# Altium schematic sheet 1_Board.schdoc.schdoc
size 309 x 223 mm; Symbol: Sheet-Symbol_A4; Device: Sheet-Symbol_A4; @Page Name: Board; @Create Date: 2023-10-25; @Page Count: 4; @Page No: 1; @Project Name: New Project_2023-10-25_23-03-02; @Schematic Name: Schematic1; @Update Date: 2023-11-27; Company: 嘉立创EDA; Page Size: A4; Version: V1.0; SheetNumber: 3; SheetTotal: 4
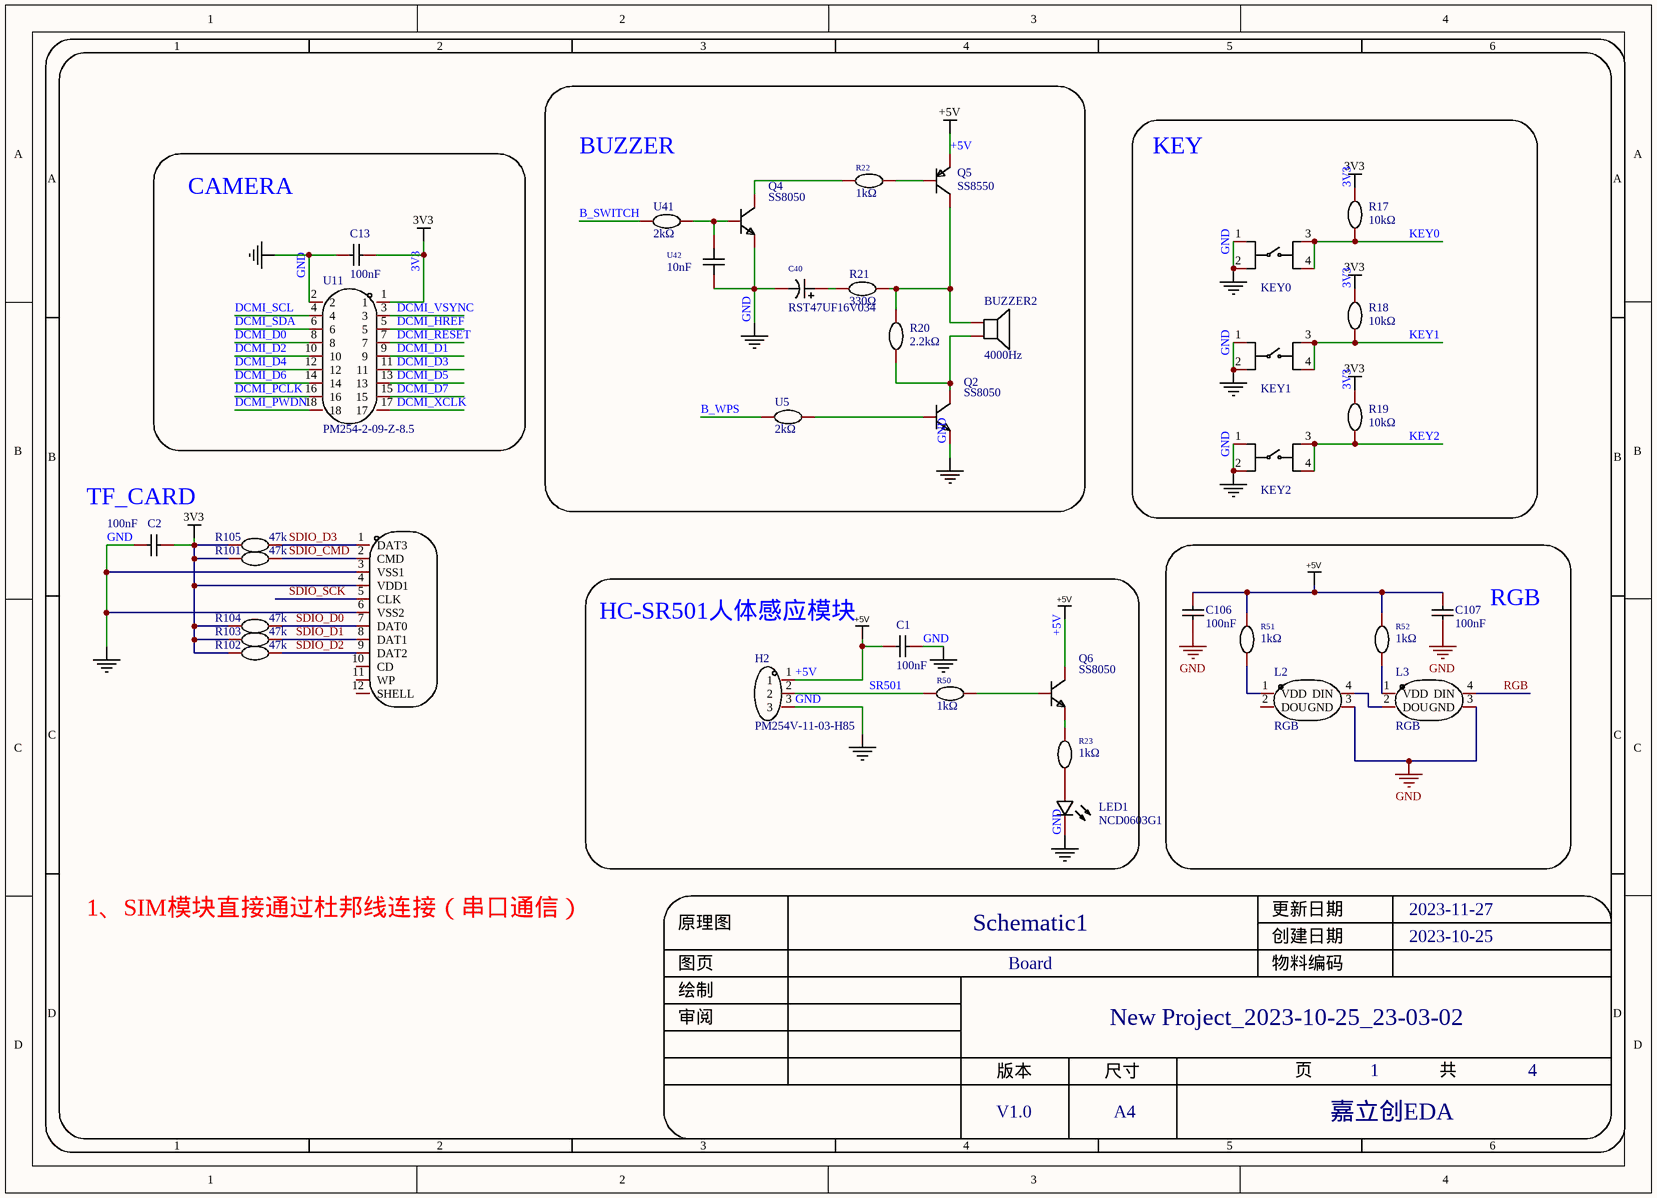
[diagram p0: 1_Board.schdoc.schdoc]

## Parts
BUZZER2  4000Hz  [BUZ-TH_BD14.0-P7.60-D0.7-FD]
C1  100nF  [C0603]
C2  100nF  [C0603]
C13  100nF  [C0603]
C40  RST47UF16V034  [CAP-SMD_BD5.0-L5.3-W5.3-LS6.0-FD]
C106  100nF  [C0603]
C107  100nF  [C0603]
H2  PM254V-11-03-H85  [HDR-TH_3P-P2.54-V-F]
KEY0  K2-6639SP-C4SC-04  [KEY-SMD_4P-L6.0-W6.0-P3.90-LS10.0]  (value not drawn)
KEY1  K2-6639SP-C4SC-04  [KEY-SMD_4P-L6.0-W6.0-P3.90-LS10.0]  (value not drawn)
KEY2  K2-6639SP-C4SC-04  [KEY-SMD_4P-L6.0-W6.0-P3.90-LS10.0]  (value not drawn)
L2  RGB  [RGB]
L3  RGB  [RGB]
LED1  NCD0603G1  [LED0603-RD]
Q2  SS8050  [SOT-23-3_L2.9-W1.3-P1.90-LS2.4-BR]
Q4  SS8050  [SOT-23-3_L2.9-W1.3-P1.90-LS2.4-BR]
Q5  SS8550  [SOT-23-3_L2.9-W1.3-P1.90-LS2.4-BR]
Q6  SS8050  [SOT-23-3_L2.9-W1.3-P1.90-LS2.4-BR]
R17  10kΩ  [R0603]
R18  10kΩ  [R0603]
R19  10kΩ  [R0603]
R20  2.2kΩ  [R0603]
R21  330Ω  [R0603]
R22  1kΩ  [R0603]
R23  1kΩ  [R0603]
R50  1kΩ  [R0603]
R51  1kΩ  [R0603]
R52  1kΩ  [R0603]
R101  47k  [R0603]
R102  47k  [R0603]
R103  47k  [R0603]
R104  47k  [R0603]
R105  47k  [R0603]
SD??  SD-112  [PCBComponent_1]  (value not drawn)
U5  2kΩ  [R0603]
U11  PM254-2-09-Z-8.5  [HDR-TH_18P-P2.54-V-F-R2-C9-S2.54]
U41  2kΩ  [R0603]
U42  10nF  [C0603]

## Blocks framed on the sheet
BUZZER: BUZZER2 C40 Q2 Q4 Q5 R20-R22 U5 U41 U42
KEY: KEY0-KEY2 R17-R19
CAMERA: C13 U11
RGB: C106 C107 L2 L3 R51 R52
HC-SR501人体感应模块: C1 H2 LED1 Q6 R23 R50

## Nets
3V3: C2.2 C13.2 R17.2 R18.2 R19.2 R101.2 R102.2 R103.2 R104.2 R105.2 SD??.4(VDD1) U11.1
+5V: C1.2 C106.1 C107.1 H2.1 Q5.2(E) Q6.3(C) R51.2 R52.2
GND: C1.1 C2.1 C13.1 C40.2 C106.2 C107.2 H2.3 KEY0.1 KEY0.2 KEY1.1 KEY1.2 KEY2.1 KEY2.2 L2.3(GND) L3.3(GND) LED1.1(K) Q2.2(E) Q4.2(E) SD??.3(VSS1) SD??.6(VSS2) U11.2 U42.1
B_SWITCH: U41.2
B_WPS: U5.2
DCMI_D0: U11.8
DCMI_D1: U11.9
DCMI_D2: U11.10
DCMI_D3: U11.11
DCMI_D4: U11.12
DCMI_D5: U11.13
DCMI_D6: U11.14
DCMI_D7: U11.15
DCMI_HREF: U11.5
DCMI_PCLK: U11.16
DCMI_PWDN: U11.18
DCMI_RESET: U11.7
DCMI_SCL: U11.4
DCMI_SDA: U11.6
DCMI_VSYNC: U11.3
DCMI_XCLK: U11.17
KEY0: KEY0.3 KEY0.4 R17.1
KEY1: KEY1.3 KEY1.4 R18.1
KEY2: KEY2.3 KEY2.4 R19.1
RGB: L3.4(DIN)
SDIO_CMD: R101.1 SD??.2(CMD)
SDIO_D0: R104.1 SD??.7(DAT0)
SDIO_D1: R103.1 SD??.8(DAT1)
SDIO_D2: R102.1 SD??.9(DAT2)
SDIO_D3: R105.1 SD??.1(DAT3)
SDIO_SCK: SD??.5(CLK)
SR501: H2.2 R50.2
NetBUZZER2_1: BUZZER2.1 Q5.3(C) R20.2 R21.2
NetBUZZER2_2: BUZZER2.2 Q2.3(C) R20.1
NetC40_1: C40.1 R21.1
NetL2_1: L2.1(VDD) R51.1
NetL2_4: L2.4(DIN) L3.2(DOU)
NetL3_1: L3.1(VDD) R52.1
NetLED1_2: LED1.2(A) R23.1
NetQ2_1: Q2.1(B) U5.1
NetQ4_1: Q4.1(B) U41.1 U42.2
NetQ4_3: Q4.3(C) R22.1
NetQ5_1: Q5.1(B) R22.2
NetQ6_1: Q6.1(B) R50.1
NetQ6_2: Q6.2(E) R23.2

Not connected (* = marked no-connect by the designer): L2 2(DOU); SD?? 10(CD) 11(WP) 12(SHELL)

## Notes on the sheet
- (near C2) TF_CARD
- 1、SIM模块直接通过杜邦线连接（串口通信）
- 1
- 2
- 3
- 4
- 5
- 6
- A
- B
- C
- 原理图
- Schematic1
- 创建日期
- 更新日期
- 2023-10-25
- 2023-11-27
- D
- 审阅
- 绘制
- 图页
- Board
- 物料编码
- New Project_2023-10-25_23-03-02
- 版本
- 尺寸
- 页
- 共
- V1.0
- A4
- 嘉立创EDA

## Library data of the parts
BUZZER2 = SFN-1407PA7.6: 驱动方式:无源(外部驱动);构造类型:压电式;额定电压:-;工作电压:-;消耗电流:-;频率:4000Hz;声压(SPL):85dB@5V,10cm;直径(φD):14mm;长度:-;宽度:-;高度:7.5mm;工作温度:-;; Manufacturer: S&amp;S(海旭); Add into BOM: yes; Technology Type: 压电式; Name: 4000Hz; Symbol: SFN-1407PA7.6; Device: SFN-1407PA7.6; LCSC Part Name: 压电无源蜂鸣器; Supplier Part: C360603; Manufacturer Part: SFN-1407PA7.6; Supplier Footprint: 插件,P=7.6mm; JLCPCB Part Class: 扩展库; Datasheet: https://atta.szlcsc.com/upload/public/pdf/source/20190422/C360603_0050A9658ADA60D80C9948846F925782.pdf; Supplier: LCSC; Convert to PCB: yes; Oscillator Circuit: 无源(外部驱动); Rated Voltage: -; Operating Voltage: -; Current Consumption: -; Value: 4000Hz; Sound Pressure Level (SPL): 85dB@5V,10cm; Diameter (φD): 14mm; Length: -; Width: -; Height: 7.5mm; Operating Temperature: -
C1 C2 C13 C106 C107 = 0603B104K500NT: 容值:100nF;精度:±10%;额定电压:50V;材质(温度系数):X7R;; Manufacturer: FH(风华); Add into BOM: yes; Tolerance: ±10%; Voltage Rated: 50V; Temperature Coefficient: X7R; Name: 100nF; Symbol: 0603B104K500NT; Device: 0603B104K500NT; LCSC Part Name: 100nF ±10% 50V; Supplier Part: C30926; Manufacturer Part: 0603B104K500NT; Supplier Footprint: 0603; JLCPCB Part Class: 扩展库; Datasheet: https://atta.szlcsc.com/upload/public/pdf/source/20170923/C30926_1506149436298988724.pdf; Supplier: LCSC; Convert to PCB: yes; Value: 100nF
C40 = RST47UF16V034: RST宽温通用品 105℃2000小时 等同RVT VT XT系列贴片电解电容; Manufacturer: KNSCHA(科尼盛); Add into BOM: yes; Capacitance: 47uF; Name: RST47UF16V034; Symbol: RST47UF16V034; Device: RST47UF16V034; LCSC Part Name: 贴片型铝电解电容 47uF ±20% 16V; Supplier Part: C4747957; Manufacturer Part: RST47UF16V034; Supplier Footprint: SMD,5x5.4mm; JLCPCB Part Class: 扩展库; Supplier: LCSC; Convert to PCB: yes
H2 = PM254V-11-03-H85: 排数:单排;总孔位数:3P;间距:2.54mm;插孔结构:1x3P;行距:-;安装类型:直插;塑高:-;触头材质:黄铜;触头镀层:-;; Manufacturer: XFCN(兴飞); Add into BOM: yes; Number of Holes: 3P; Pitch: 2.54mm; Holes Structure: 1x3P; Name: PM254V-11-03-H85; Symbol: PM254V-11-03-H85; Device: PM254V-11-03-H85; LCSC Part Name: 间距:2.54mm 1x3P 直插; Supplier Part: C541850; Manufacturer Part: PM254V-11-03-H85; Supplier Footprint: 插件,P=2.54mm; JLCPCB Part Class: 扩展库; Datasheet: https://atta.szlcsc.com/upload/public/pdf/source/20200518/C541849_85853D71FC67C51915A806977A588FDA.pdf; Supplier: LCSC; Convert to PCB: yes; Number of Rows: 单排; Row Spacing: -; Mounting Type: 直插; Insulation Height: -; Contact Material: 黄铜; Contact Plating: -
KEY0-KEY2 = K2-6639SP-C4SC-04: 触点电流:50mA;额定电压(DC):12V;绝缘电阻:100MΩ;安装方式:立贴;作用力:250gf@±30gf;机械寿命:1000000;工作温度:-25℃~+85℃;开关长度:6mm;开关宽度:6mm;开关高度:5mm;; Manufacturer: 韩国韩荣; Symbol: K2-6639SP-C4SC-04_C879344; Add into BOM: yes; Contact Current: 50mA; Voltage Rating (DC): 12V; Insulation Resistance: 100MΩ; Mounting Sytle: 立贴; Switch Length: 6mm; Switch Height: 5mm; Name: K2-6639SP-C4SC-04; Device: K2-6639SP-C4SC-04; LCSC Part Name: K2-6639SP-C4SC-04; Supplier Part: C879344; Manufacturer Part: K2-6639SP-C4SC-04; Supplier Footprint: SMD; JLCPCB Part Class: 扩展库; Datasheet: https://atta.szlcsc.com/upload/public/pdf/source/20200721/C707344_FB3B602593668C8FE1542A3F64DDEE0A.pdf; Supplier: LCSC; Convert to PCB: yes; Operating Force: 250gf@±30gf; Mechanical Life: 1000000; Operating Temperature: -25℃~+85℃; Switch Width: 6mm
LED1 = NCD0603G1: 发光颜色:翠绿色;功率:72mW;透镜颜色:无色透明;主波长:515nm~530nm;发光强度:330mcd~900mcd;发光角度:130°;工作温度:-30℃~+85℃;; Manufacturer: 国星光电; Symbol: FC-D1608UGK-520D10; Add into BOM: yes; Emitted Color: 翠绿色; Forward Voltage (VF): 2.6V~3.6V; Forward Current: 10mA; Power Dissipation: 72mW; Lens Color: 无色透明; Viewing Angle: 130°; Name: NCD0603G1; Device: NCD0603G1; LCSC Part Name: 翠绿 0603翠绿  正贴; Supplier Part: C84267; Manufacturer Part: NCD0603G1; Supplier Footprint: 0603; JLCPCB Part Class: 扩展库; Datasheet: https://atta.szlcsc.com/upload/public/pdf/source/20200820/C84267_04BA7703640BAC111D09F5EFB971FBF3.pdf; Supplier: LCSC; Convert to PCB: yes; Dominant Wavelength: 515nm~530nm; Luminous Intensity: 330mcd~900mcd; Operating Temperature: -30℃~+85℃
Q2 Q4 Q6 = SS8050_C2150: 直流电流增益(hFE@Ic,Vce):200@100mA,1V;功率(Pd):300mW;集射极击穿电压(Vceo):25V;集电极电流(Ic):1.5A;晶体管类型:NPN;; Manufacturer: CJ(江苏长电/长晶); Add into BOM: yes; Power Dissipation (Pd): 300mW; Transition Frequency (fT): 100MHz; Collector-Emitter Breakdown Voltage (Vceo): 25V; Collector Current (Ic): 1.5A; Collector Cut-Off Current (Icbo): 100nA; Collector-Emitter Saturation Voltage (VCE(sat)@Ic,Ib): 500mV@800mA,80mA; Transistor Type: NPN; Name: SS8050; Symbol: SS8050_C2150; Device: SS8050_C2150; LCSC Part Name: 耐压:25V 电流:1.5A NPN Y1 200-350; Supplier Part: C2150; Manufacturer Part: SS8050; Supplier Footprint: SOT-23; JLCPCB Part Class: 基础库; Datasheet: https://atta.szlcsc.com/upload/public/pdf/source/20230322/AEE86F4B043774EFF80CAEA14A37D9E9.pdf; Supplier: LCSC; Convert to PCB: yes; DC Current Gain (hFE@Ic,Vce): 200@100mA,1V; Operating Temperature: +150℃@(Tj)
Q5 = SS8550: Manufacturer: Doeshare(德芯); Symbol: SS8550_C2931718; Add into BOM: yes; Name: SS8550; Device: SS8550; LCSC Part Name: PNP -25V -1.5A 120-400 SOT-23; Supplier Part: C2931718; Manufacturer Part: SS8550; Supplier Footprint: SOT-23; JLCPCB Part Class: 扩展库; Datasheet: https://atta.szlcsc.com/upload/public/pdf/source/20220104/E36293975455CDB0A899354BE4C8E85F.pdf; Supplier: LCSC; Convert to PCB: yes
R17-R19 = SCR0603J10K: 阻值:10kΩ;精度:±5%;; Manufacturer: VO(翔胜); Add into BOM: yes; Tolerance: ±5%; Name: 10kΩ; Symbol: SCR0603J10K; Device: SCR0603J10K; LCSC Part Name: 10kΩ ±5%; Supplier Part: C3017715; Manufacturer Part: SCR0603J10K; Supplier Footprint: 0603; JLCPCB Part Class: 扩展库; Datasheet: https://atta.szlcsc.com/upload/public/pdf/source/20220513/247AF9639BA21CF93567DC289CCC6A22.pdf; Supplier: LCSC; Convert to PCB: yes; Value: 10kΩ
R20 = SCR0603J2K2: 阻值:2.2kΩ;精度:±5%;; Manufacturer: VO(翔胜); Add into BOM: yes; Tolerance: ±5%; Name: 2.2kΩ; Symbol: SCR0603J2K2; Device: SCR0603J2K2; LCSC Part Name: 2.2kΩ ±5%; Supplier Part: C3017730; Manufacturer Part: SCR0603J2K2; Supplier Footprint: 0603; JLCPCB Part Class: 扩展库; Datasheet: https://atta.szlcsc.com/upload/public/pdf/source/20220513/247AF9639BA21CF93567DC289CCC6A22.pdf; Supplier: LCSC; Convert to PCB: yes; Value: 2.2kΩ
R21 = TC0325B3300T5F: 阻值:330Ω;精度:±0.1%;功率:100mW;温度系数:±25ppm/℃;电阻类型:薄膜电阻;; Manufacturer: UNI-ROYAL(厚声); Add into BOM: yes; Tolerance: ±0.1%; Power(Watts): 100mW; Overload Voltage (Max): 75V; Name: 330Ω; Symbol: TC0325B3300T5F; Device: TC0325B3300T5F; LCSC Part Name: 330Ω ±0.1% 100mW 薄膜电阻; Supplier Part: C2989271; Manufacturer Part: TC0325B3300T5F; Supplier Footprint: 0603; JLCPCB Part Class: 扩展库; Datasheet: https://atta.szlcsc.com/upload/public/pdf/source/20220708/6ACD1707201702E70C0F417A19EB926E.pdf; Supplier: LCSC; Convert to PCB: yes; Value: 330Ω; Temperature Coefficient: ±25ppm/℃; Type: 薄膜电阻
R22 R23 R50-R52 = SCR0603F1K: 阻值:1kΩ;精度:±1%;; Manufacturer: VO(翔胜); Add into BOM: yes; Tolerance: ±1%; Name: 1kΩ; Symbol: SCR0603F1K; Device: SCR0603F1K; LCSC Part Name: 1kΩ ±1%; Supplier Part: C3016283; Manufacturer Part: SCR0603F1K; Supplier Footprint: 0603; JLCPCB Part Class: 扩展库; Datasheet: https://atta.szlcsc.com/upload/public/pdf/source/20220513/247AF9639BA21CF93567DC289CCC6A22.pdf; Supplier: LCSC; Convert to PCB: yes; Value: 1kΩ
R101-R105 = RTX032001BETP: 阻值:47kΩ;精度:±0.1%;; Manufacturer: RALEC(旺诠); Name: 2kΩ; Add into BOM: yes; Value: 2kΩ; Tolerance: ±0.1%; Temperature Coefficient: ±50ppm/℃; Symbol: RTX032001BETP; Device: RTX032001BETP; LCSC Part Name: 2kΩ ±0.1%; Supplier Part: C5141181; Manufacturer Part: RTX032001BETP; Supplier Footprint: 0603; Datasheet: https://atta.szlcsc.com/upload/public/pdf/source/20220822/046AFDAF81466BFF443BF7BC902F6DB1.pdf; Supplier: LCSC; Convert to PCB: yes
SD?? = SD-112: Manufacturer: HANBO(汉博); Add into BOM: yes; Card Connection Mode: 拔插式; Card Type: 标准SD卡; Connector Type: 卡座; Maximum Body Height: 2.75mm; Symbol: SD-112; Device: SD-112; Supplier: LCSC; Supplier Part: C961673; Manufacturer Part: SD-112; JLCPCB Part Class: Extended Part; LCSC Part Name: 拔插式 标准SD卡 卡座; Supplier Footprint: SMD; Datasheet: https://atta.szlcsc.com/upload/public/pdf/source/20221111/3DA5FA45280C889584A9D758FC9BB3ED.pdf; Convert to PCB: yes; Contact Plating: 镀金; Operating Temperature Range: -25℃~+90℃
U5 U41 = RTX032001BETP: 阻值:2kΩ;精度:±0.1%;; Manufacturer: RALEC(旺诠); Add into BOM: yes; Tolerance: ±0.1%; Temperature Coefficient: ±50ppm/℃; Name: 2kΩ; Symbol: RTX032001BETP; Device: RTX032001BETP; LCSC Part Name: 2kΩ ±0.1%; Supplier Part: C5141181; Manufacturer Part: RTX032001BETP; Supplier Footprint: 0603; Datasheet: https://atta.szlcsc.com/upload/public/pdf/source/20220822/046AFDAF81466BFF443BF7BC902F6DB1.pdf; Supplier: LCSC; Convert to PCB: yes; Value: 2kΩ
U11 = PM254-2-09-Z-8.5: 排数:双排;总孔位数:18P;间距:2.54mm;插孔结构:2x9P;行距:2.54mm;安装类型:直插;圆孔/方孔:方孔;额定电流:3A;额定电压:-;插孔方向:顶部;塑高:8.5mm;工作温度范围:-40℃~+105℃;; Manufacturer: HCTL(华灿天禄); Add into BOM: yes; Number of Holes: 18P; Pitch: 2.54mm; Holes Structure: 2x9P; Circular Hole / Square Hole: 方孔; Current Rating (Max): 3A; Holes Direction: 顶部; Name: PM254-2-09-Z-8.5; Symbol: PM254-2-09-Z-8.5; Device: PM254-2-09-Z-8.5; LCSC Part Name: 间距:2.54mm 2x9P 直插; Supplier Part: C2897410; Manufacturer Part: PM254-2-09-Z-8.5; Supplier Footprint: 插件,P=2.54mm; JLCPCB Part Class: 扩展库; Datasheet: https://atta.szlcsc.com/upload/public/pdf/source/20230609/3D36CA2C1BFC9FD1C3F709AD9DFEB9C2.pdf; Supplier: LCSC; Convert to PCB: yes; Number of Rows: 双排; Row Spacing: 2.54mm; Mounting Type: 直插; Voltage Rating (Max): -; Insulation Height: 8.5mm; Operating Temperature Range: -40℃~+105℃
U42 = C1608X8R2A103K080AA: 容值:10nF;精度:±10%;额定电压:100V;材质(温度系数):X8R;; Manufacturer: TDK; Add into BOM: yes; Tolerance: ±10%; Voltage Rated: 100V; Temperature Coefficient: X8R; Name: 10nF; Symbol: C1608X8R2A103K080AA; Device: C1608X8R2A103K080AA; LCSC Part Name: 10nF ±10% 100V; Supplier Part: C3865495; Manufacturer Part: C1608X8R2A103K080AA; Supplier Footprint: 0603; Supplier: LCSC; Convert to PCB: yes; Value: 10nF